# EAGLE schematic Node#1 (EAGLE 9.2.1)
Assembly variants: Relais, Mosfet

## Sheet 1 of 7
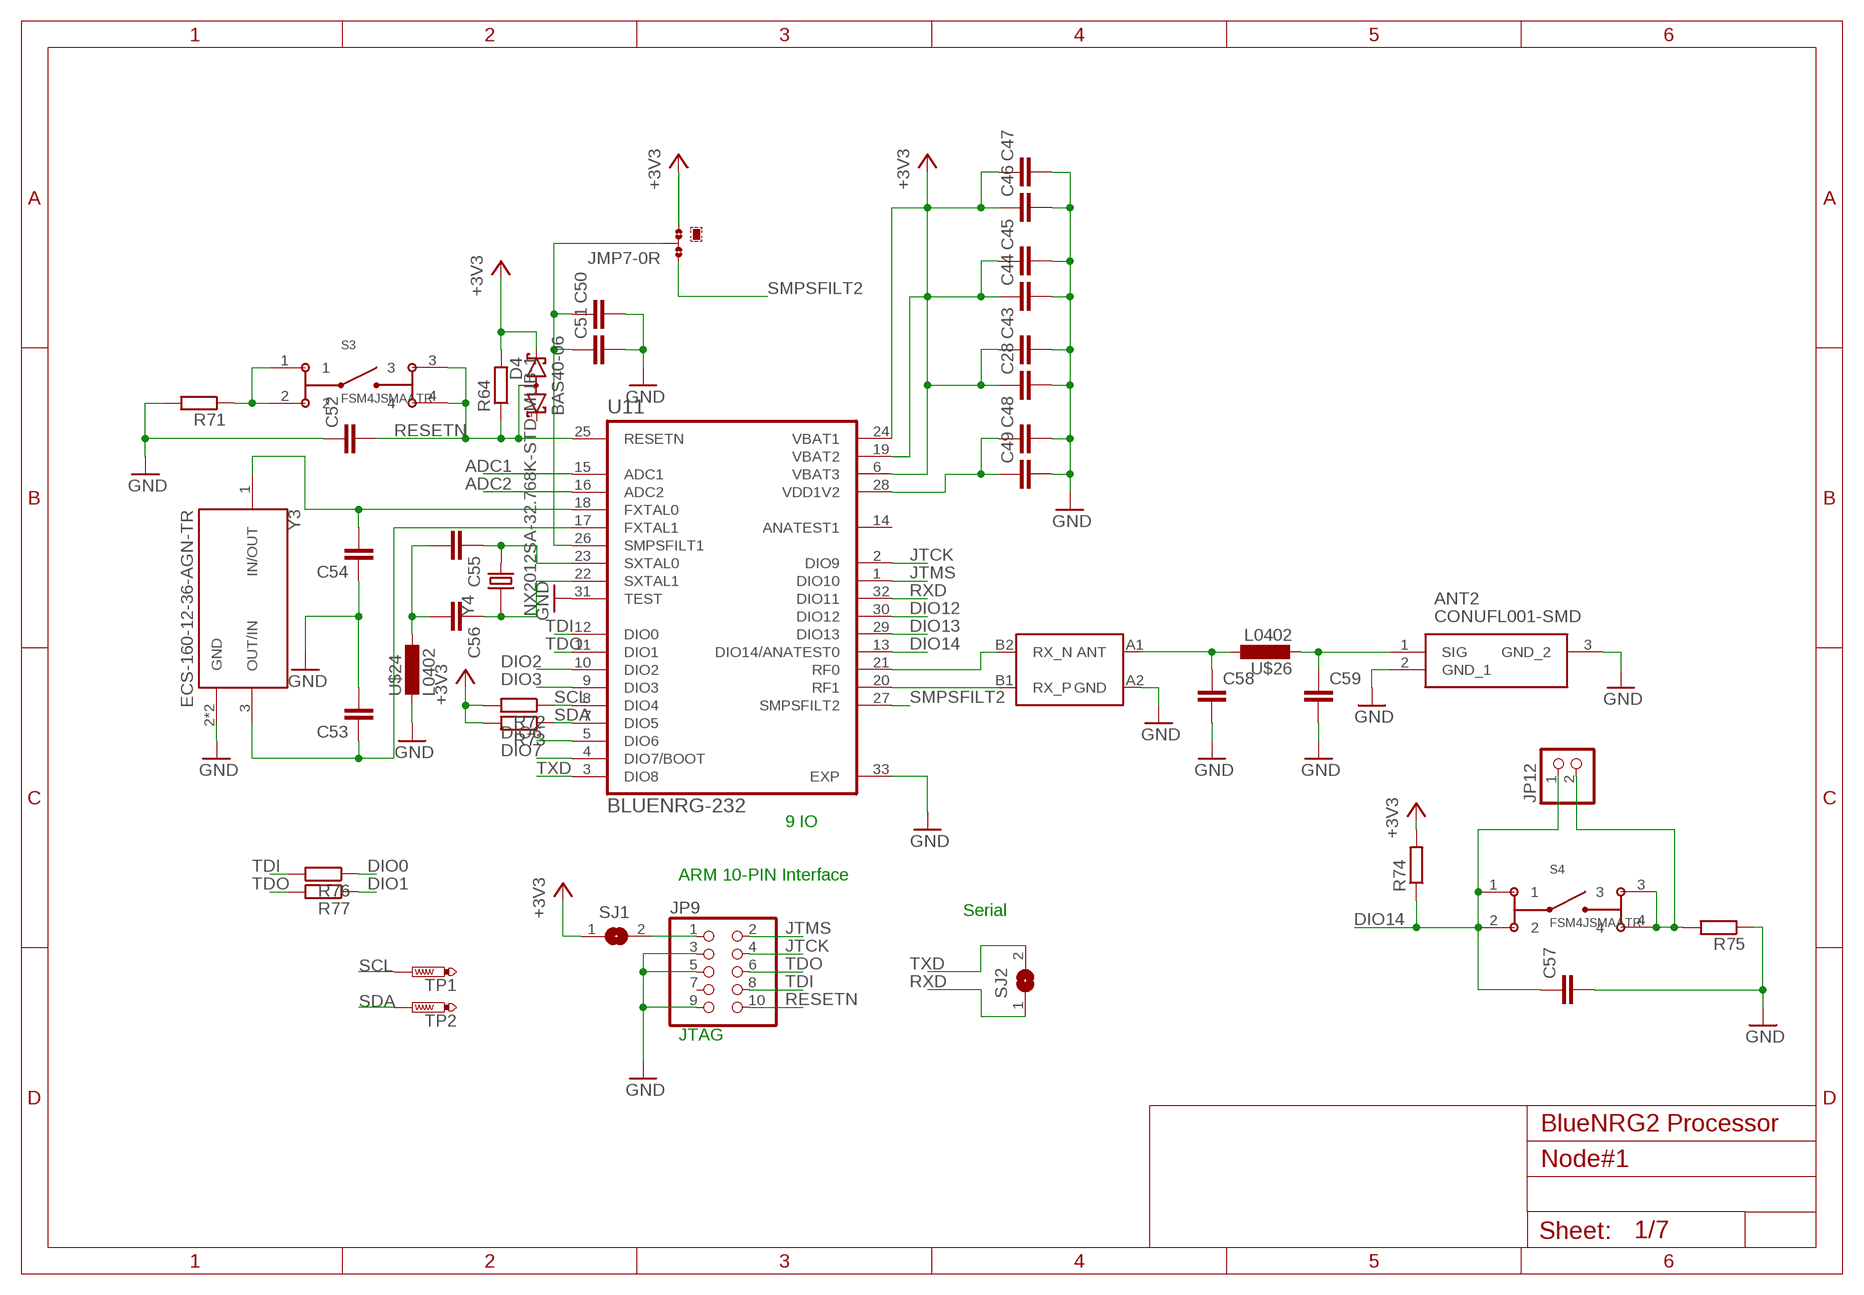
[diagram p0: schematic, sheet 1]

### Parts
ANT2  CONUFL001-SMD  [CONUFL001-SMD]
C28  C-EUC0805K  [C0805K]
C43  C-EUC0805K  [C0805K]
C44  C-EUC0805K  [C0805K]
C45  C-EUC0805K  [C0805K]
C46  C-EUC0805K  [C0805K]
C47  C-EUC0805K  [C0805K]
C48  C-EUC0805K  [C0805K]
C49  C-EUC0805K  [C0805K]
C50  C-EUC0805K  [C0805K]
C51  C-EUC0805K  [C0805K]
C52  C-EUC0805  [C0805]
C53  C-EUC0805  [C0805]
C54  C-EUC0805  [C0805]
C55  C-EUC0805  [C0805]
C56  C-EUC0805  [C0805]
C57  C-EUC0805  [C0805]
C58  C-EUC0402  [C0402]
C59  C-EUC0402  [C0402]
D4  BAS40-06  [SOT23]
JMP7  0R-JUMPA  [A0R-JMP]
JP9  PINHD-2X5  [2X05]
JP12  PINHD-1X2  [1X02]
R64  R-EU_R0805  [R0805]
R71  R-EU_R0805  [R0805]
R72  R-EU_R0805  [R0805]
R73  R-EU_R0805  [R0805]
R74  R-EU_M0805  [M0805]
R75  R-EU_M0805  [M0805]
R76  R-EU_R0805  [R0805]
R77  R-EU_R0805  [R0805]
S3  FSM4JSMAATR  [SW_FSM4JSMAATR]
S4  FSM4JSMAATR  [SW_FSM4JSMAATR]
SJ1  SJ  [SJ]
SJ2  SJ  [SJ]
TP1  PTR1TP20R  [TP20R]
TP2  PTR1TP20R  [TP20R]
U11  BLUENRG-232  [QFN50P500X500X100-33T345N]
U$24  L0402  [R0402]
U$25  BALF-NRG-01D3  [FLIPCHIP]
U$26  L0402  [R0402]
Y3  ECS-160-12-36-AGN-TR  [XTAL_ECS-160-12-36-AGN-TR]
Y4  NX2012SA-32.768K-STD-MUB-1  [XTAL_NX2012SA-32.768K-STD-MUB-1]

### Nets
+3V3: C28.1 C43.1 C44.1 C45.1 C46.1 C47.1 D4.2(K2) JMP7.3 R64.2 R72.2 R73.2 R74.2 SJ1.1 U11.6(VBAT3) U11.19(VBAT2) U11.24(VBAT1) ; also sheet 2,3,4,6
ADC1: U11.15(ADC1)
ADC2: U11.16(ADC2) ; also sheet 3,5
DIO0: R76.1
DIO1: R77.1
DIO2: U11.10(DIO2) ; also sheet 3
DIO3: U11.9(DIO3) ; also sheet 3
DIO6: U11.5(DIO6) ; also sheet 3
DIO7: U11.4(DIO7/BOOT) ; also sheet 3
DIO12: U11.30(DIO12) ; also sheet 4,7
DIO13: U11.29(DIO13) ; also sheet 6
DIO14: C57.1 JP12.1 R74.1 S4.1 S4.2 U11.13(DIO14/ANATEST0)
GND: ANT2.2(GND_1) ANT2.3(GND_2) C28.2 C43.2 C44.2 C45.2 C46.2 C47.2 C48.2 C49.2 C50.2 C51.2 C52.1 C53.2 C54.1 C57.2 C58.2 C59.2 JP9.3 JP9.5 JP9.9 R71.2 R75.1 U11.31(TEST) U11.33(EXP) U$24.2 U$25.A2(GND) Y3.2(GND) Y3.4(GND) ; also sheet 2,3,4,5,6,7
JTCK: JP9.4 U11.2(DIO9)
JTMS: JP9.2 U11.1(DIO10)
N$15: C48.1 C49.1 U11.28(VDD1V2)
N$18: C50.1 C51.1 JMP7.2 U11.26(SMPSFILT1)
N$20: R71.1 S3.1 S3.2
N$21: C53.1 U11.17(FXTAL1) Y3.3(OUT/IN)
N$22: C54.2 U11.18(FXTAL0) Y3.1(IN/OUT)
N$23: C55.2 C56.2 U$24.1
N$24: C55.1 U11.23(SXTAL0) Y4.2
N$25: C56.1 U11.22(SXTAL1) Y4.1
N$26: C58.1 U$25.A1(ANT) U$26.1
N$27: ANT2.1(SIG) C59.1 U$26.2
N$28: JP9.1 SJ1.2
N$29: JP12.2 R75.2 S4.3 S4.4
N$30: U11.20(RF1) U$25.B1(RX_P)
N$31: U11.21(RF0) U$25.B2(RX_N)
RESETN: C52.2 D4.3(AA) JP9.10 R64.1 S3.3 S3.4 U11.25(RESETN) ; also sheet 6
RXD: SJ2.1 U11.32(DIO11)
SCL: R72.1 TP1.TP U11.8(DIO4) ; also sheet 4,6,7
SDA: R73.1 TP2.TP U11.7(DIO5) ; also sheet 4,6,7
SMPSFILT2: JMP7.1 U11.27(SMPSFILT2)
TDI: JP9.8 R76.2 U11.12(DIO0)
TDO: JP9.6 R77.2 U11.11(DIO1)
TXD: SJ2.2 U11.3(DIO8)
Unconnected: D4.1(K1) JP9.7 U11.14(ANATEST1)

### Notes on the sheet
- 9 IO
- ARM 10-PIN Interface
- Serial
- JTAG
- BlueNRG2 Processor

## Sheet 2 of 7
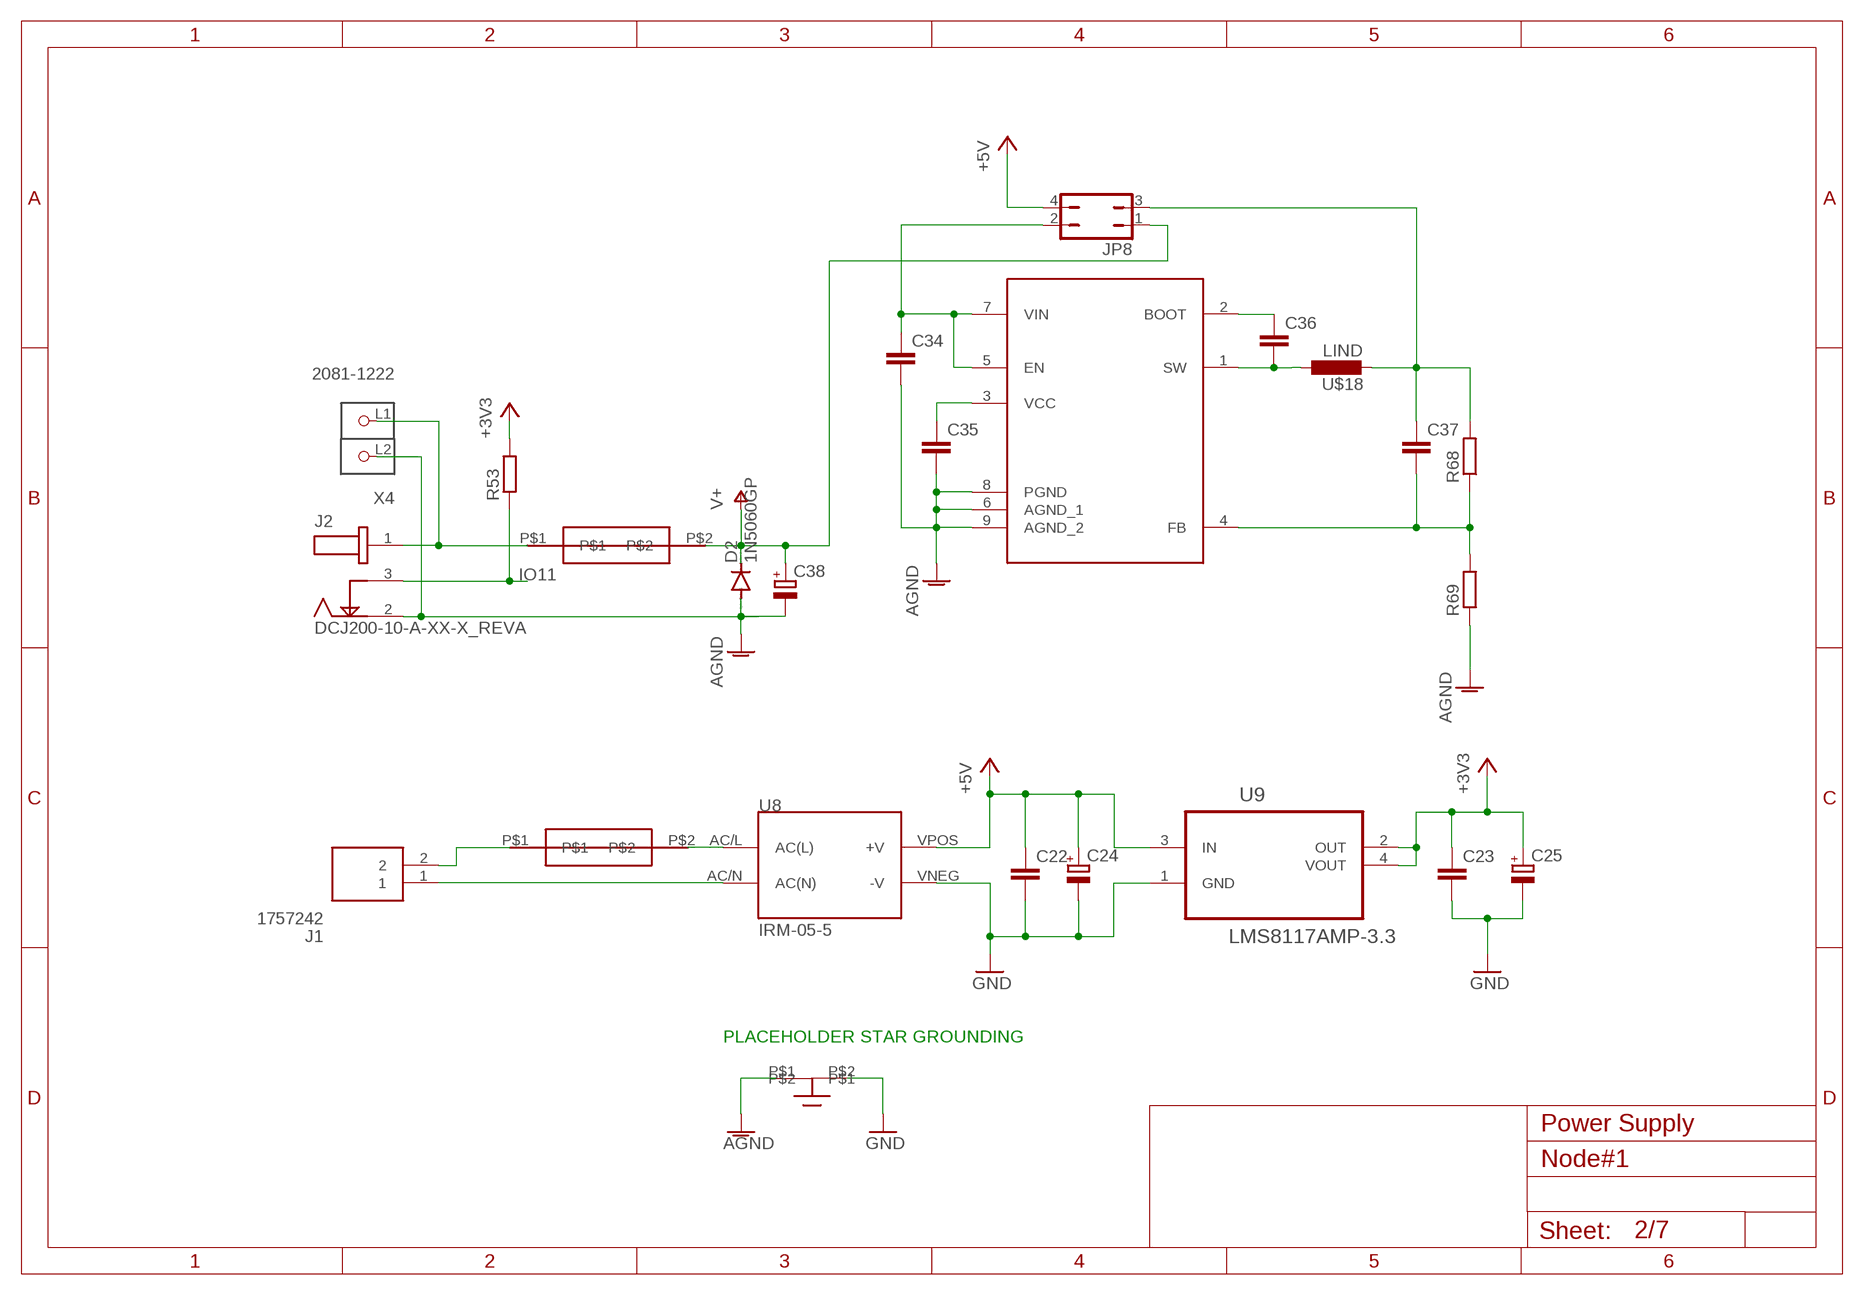
[diagram p1: schematic, sheet 2]

### Parts
C22  C-EUC0805  [C0805]
C23  C-EUC0805  [C0805]
C24  CPOL-EUSMCC  [SMC_C]
C25  CPOL-EUSMCC  [SMC_C]
C34  C-EUC0805  [C0805]
C35  C-EUC0805  [C0805]
C36  C-EUC0805  [C0805]
C37  C-EUC0805  [C0805]
C38  CPOL-EU150CLZ-1010  [150CLZ-1010]
D2  1N5060GP  [DO15-12]
J1  1757242  [SHDR2W120P0X508_1X2_1208X1200X]
J2  DCJ200-10-A-XX-X_REVA  [GCT_DCJ200-10-A-XX-X_REVA]
JP8  JP2Q  [JP2Q]
R53  R-EU_R0805  [R0805]
R68  R-EU_R0805  [R0805]
R69  R-EU_R0805  [R0805]
U8  IRM-05-5  [CONV_IRM-05-5]
U9  LMS8117AMP-3.3  [SOT230P696X180-4N]
U$9  RND170-00004  [RND170-00004]
U$18  LIND  [INDM1200X1200X1000N]
U$20  RND170-00004  [RND170-00004]
U$21  LM23610  [SOIC127P600X170-8N]
U$23  STAR_GROUND  [STAR_GROUND]
X4  2081-1222  [P-2081-1222]

### Nets
+3V3: C23.1 C25.+ R53.2 U9.2(OUT) U9.4(VOUT) ; also sheet 1,3,4,6
+5V: C22.1 C24.+ JP8.4 U8.VPOS(+V) U9.3(IN) ; also sheet 3,5,6,7
AGND: C34.2 C35.2 C38.- D2.A J2.2 R69.1 U$21.6(AGND_1) U$21.8(PGND) U$21.9(AGND_2) U$23.P$1 X4.L2(P2) ; also sheet 3,4,5
GND: C22.2 C23.2 C24.- C25.- U8.VNEG(-V) U9.1(GND) U$23.P$2 ; also sheet 1,3,4,5,6,7
IO11: J2.3 R53.1 ; also sheet 6
N$42: J2.1 U$20.P$1 X4.L1(P1)
N$45: C34.1 JP8.2 U$21.5(EN) U$21.7(VIN)
N$51: C35.1 U$21.3(VCC)
N$95: U8.AC/L(AC(L)) U$9.P$2
N$97: C36.1 U$21.2(BOOT)
N$98: J1.1 U8.AC/N(AC(N))
N$104: J1.2 U$9.P$1
N$107: C36.2 U$18.1 U$21.1(SW)
N$115: C37.2 R68.1 R69.2 U$21.4(FB)
N$116: C37.1 JP8.3 R68.2 U$18.2
V+: C38.+ D2.C JP8.1 U$20.P$2 ; also sheet 3,4

### Notes on the sheet
- PLACEHOLDER STAR GROUNDING
- Power Supply

## Sheet 3 of 7
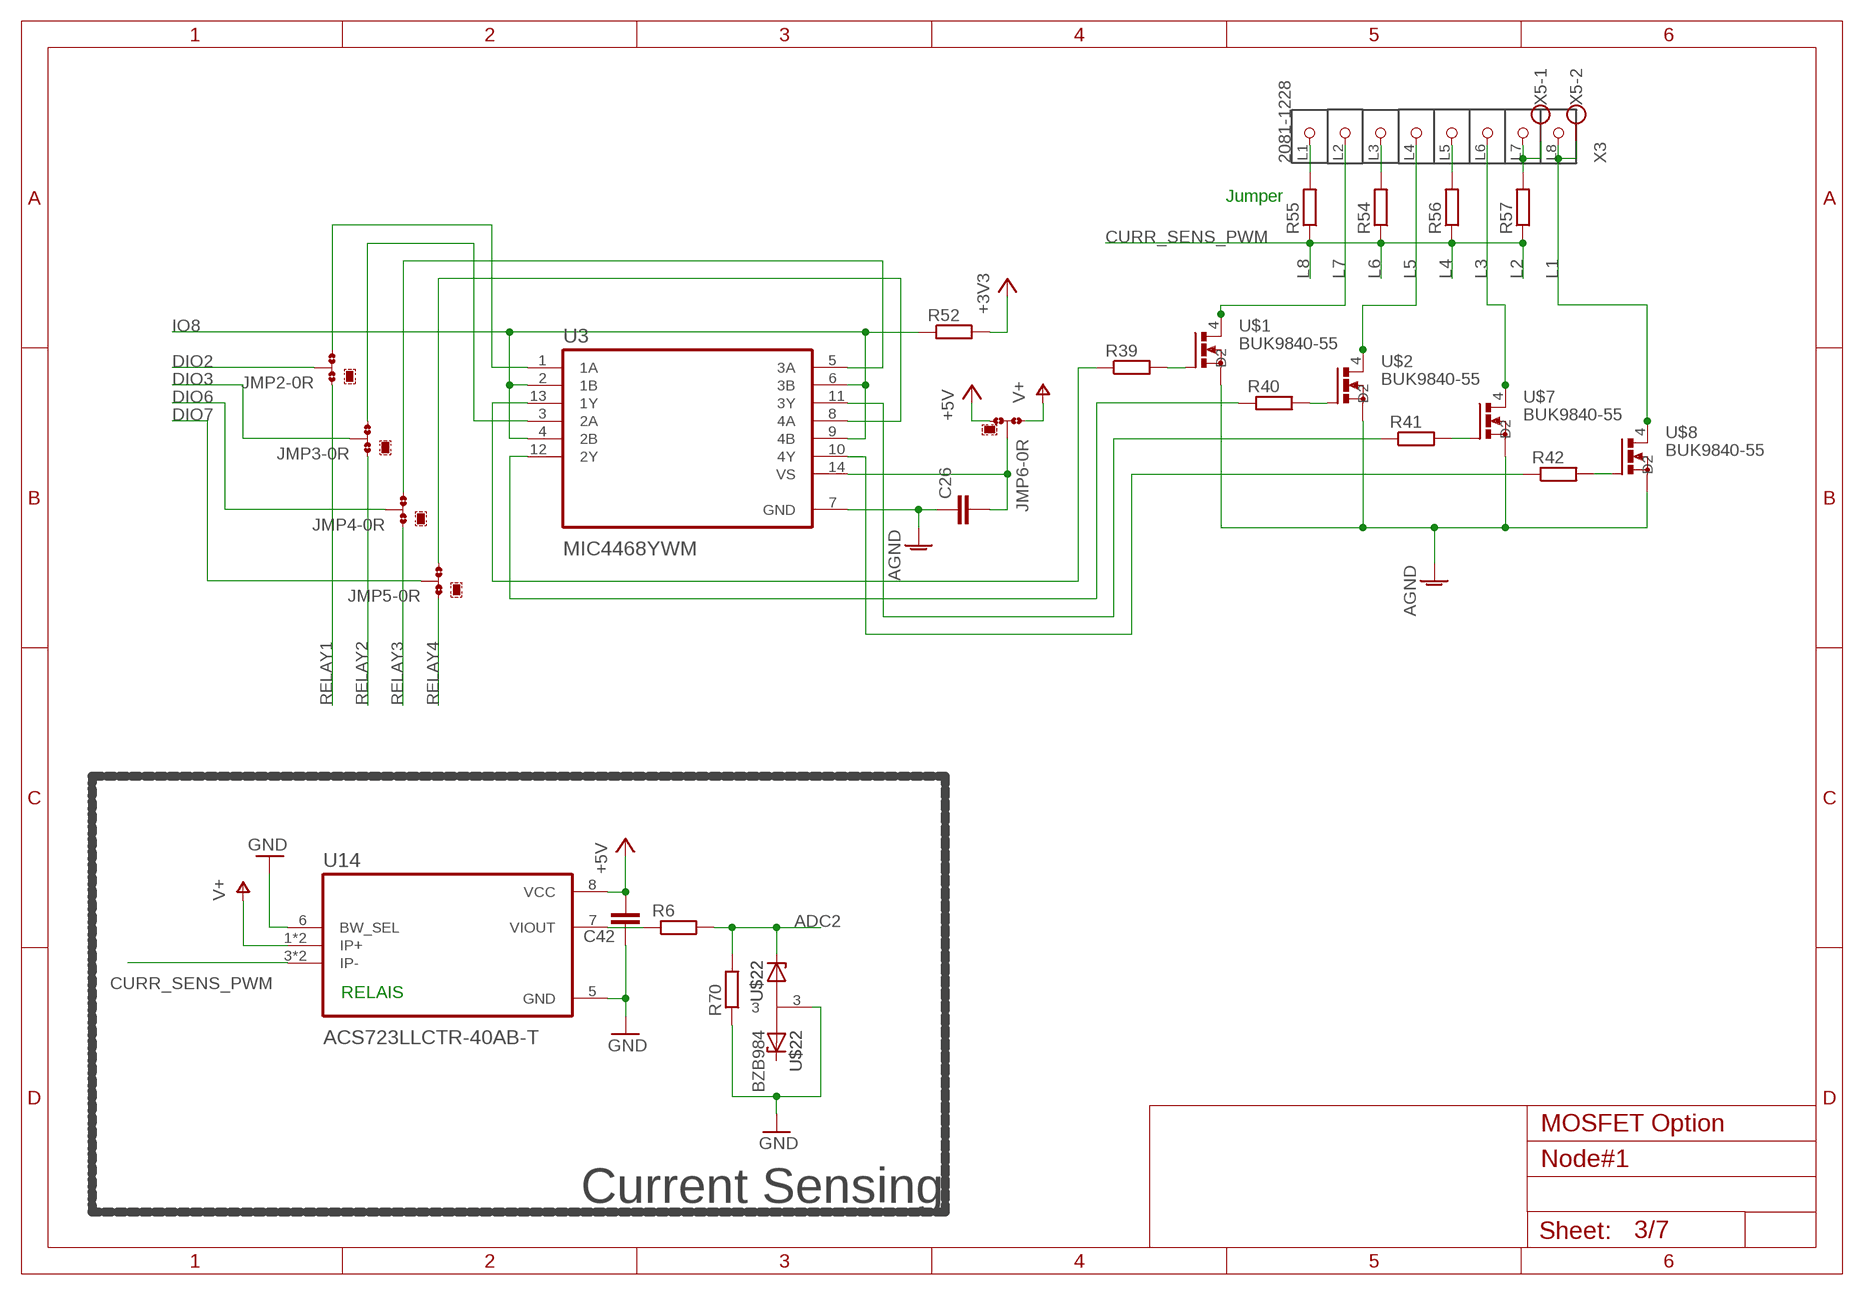
[diagram p2: schematic, sheet 3]

### Parts
C26  C-EUC0805  [C0805]  (not fitted in variant Relais)
C42  C-EUC0805  [C0805]  (not fitted in variant Relais)
JMP2  0R-JUMPA  [A0R-JMP]
JMP3  0R-JUMPA  [A0R-JMP]
JMP4  0R-JUMPA  [A0R-JMP]
JMP5  0R-JUMPA  [A0R-JMP]
JMP6  0R-JUMPA  [A0R-JMP]  (not fitted in variant Relais)
R6  R-EU_M0805  [M0805]  (not fitted in variant Relais)
R39  R-EU_M0805  [M0805]  (not fitted in variant Relais)
R40  R-EU_M0805  [M0805]  (not fitted in variant Relais)
R41  R-EU_M0805  [M0805]  (not fitted in variant Relais)
R42  R-EU_M0805  [M0805]  (not fitted in variant Relais)
R52  R-EU_M0805  [M0805]  (not fitted in variant Relais)
R54  R-EU_R1210  [R1210]  (not fitted in variant Relais)
R55  R-EU_R1210  [R1210]  (not fitted in variant Relais)
R56  R-EU_R1210  [R1210]  (not fitted in variant Relais)
R57  R-EU_R1210  [R1210]  (not fitted in variant Relais)
R70  R-EU_M0805  [M0805]  (not fitted in variant Relais)
U3  MIC4468YWM  [SOIC127P1030X265-16N]  (not fitted in variant Relais)
U14  ACS723LLCTR-40AB-T  [SOIC127P600X175-8N]  (not fitted in variant Relais)
U$1  BUK9840-55  [SOT230P696X180-4N]  (not fitted in variant Relais)
U$2  BUK9840-55  [SOT230P696X180-4N]  (not fitted in variant Relais)
U$7  BUK9840-55  [SOT230P696X180-4N]  (not fitted in variant Relais)
U$8  BUK9840-55  [SOT230P696X180-4N]  (not fitted in variant Relais)
U$22  BZB984  [SOT95P230X110-3N]  (not fitted in variant Relais)
X3  2081-1228  [P-2081-1228]
X5  W237-102  [W237-102]

### Nets
+3V3: R52.2 ; also sheet 1,2,4,6
+5V: C42.2 JMP6.3 U14.8(VCC) ; also sheet 2,5,6,7
ADC2: R6.2 R70.2 U$22.1 ; also sheet 1,5
AGND: C26.1 U3.7(GND) U$1.3(S) U$2.3(S) U$7.3(S) U$8.3(S) ; also sheet 2,4,5
CURR_SENS_PWM: R54.1 R55.1 R56.1 R57.1 U14.3(IP-) U14.4(IP-)
DIO2: JMP2.2 ; also sheet 1
DIO3: JMP3.2 ; also sheet 1
DIO6: JMP4.2 ; also sheet 1
DIO7: JMP5.2 ; also sheet 1
GND: C42.1 R70.1 U14.5(GND) U14.6(BW_SEL) U$22.3 ; also sheet 1,2,4,5,6,7
IO8: R52.1 U3.2(1B) U3.4(2B) U3.6(3B) U3.9(4B) ; also sheet 4,6
L1: U$8.2(D) U$8.4(D2) X3.L8(P8) X5.2 ; also sheet 4,5
L2: R57.2 X3.L7(P7) X5.1 ; also sheet 5
L3: U$7.2(D) U$7.4(D2) X3.L6(P6) ; also sheet 4,5
L4: R56.2 X3.L5(P5) ; also sheet 5
L5: U$2.2(D) U$2.4(D2) X3.L4(P4) ; also sheet 4,5
L6: R54.2 X3.L3(P3) ; also sheet 5
L7: U$1.2(D) U$1.4(D2) X3.L2(P2) ; also sheet 4,5
L8: R55.2 X3.L1(P1) ; also sheet 5
N$39: JMP5.3 U3.8(4A)
N$53: R39.1 U3.13(1Y)
N$55: JMP2.3 U3.1(1A)
N$56: JMP3.3 U3.3(2A)
N$57: JMP4.3 U3.5(3A)
N$67: R40.1 U3.12(2Y)
N$70: R41.1 U3.11(3Y)
N$73: R42.1 U3.10(4Y)
N$74: R39.2 U$1.1(G)
N$75: R40.2 U$2.1(G)
N$76: R41.2 U$7.1(G)
N$77: R42.2 U$8.1(G)
N$96: R6.1 U14.7(VIOUT)
N$105: C26.2 JMP6.2 U3.14(VS)
RELAY1: JMP2.1 ; also sheet 5
RELAY2: JMP3.1 ; also sheet 5
RELAY3: JMP4.1 ; also sheet 5
RELAY4: JMP5.1 ; also sheet 5
V+: JMP6.1 U14.1(IP+) U14.2(IP+) ; also sheet 2,4
Unconnected: U$22.2

### Notes on the sheet
- Jumper
- RELAIS
- MOSFET Option
- Current Sensing

## Sheet 4 of 7
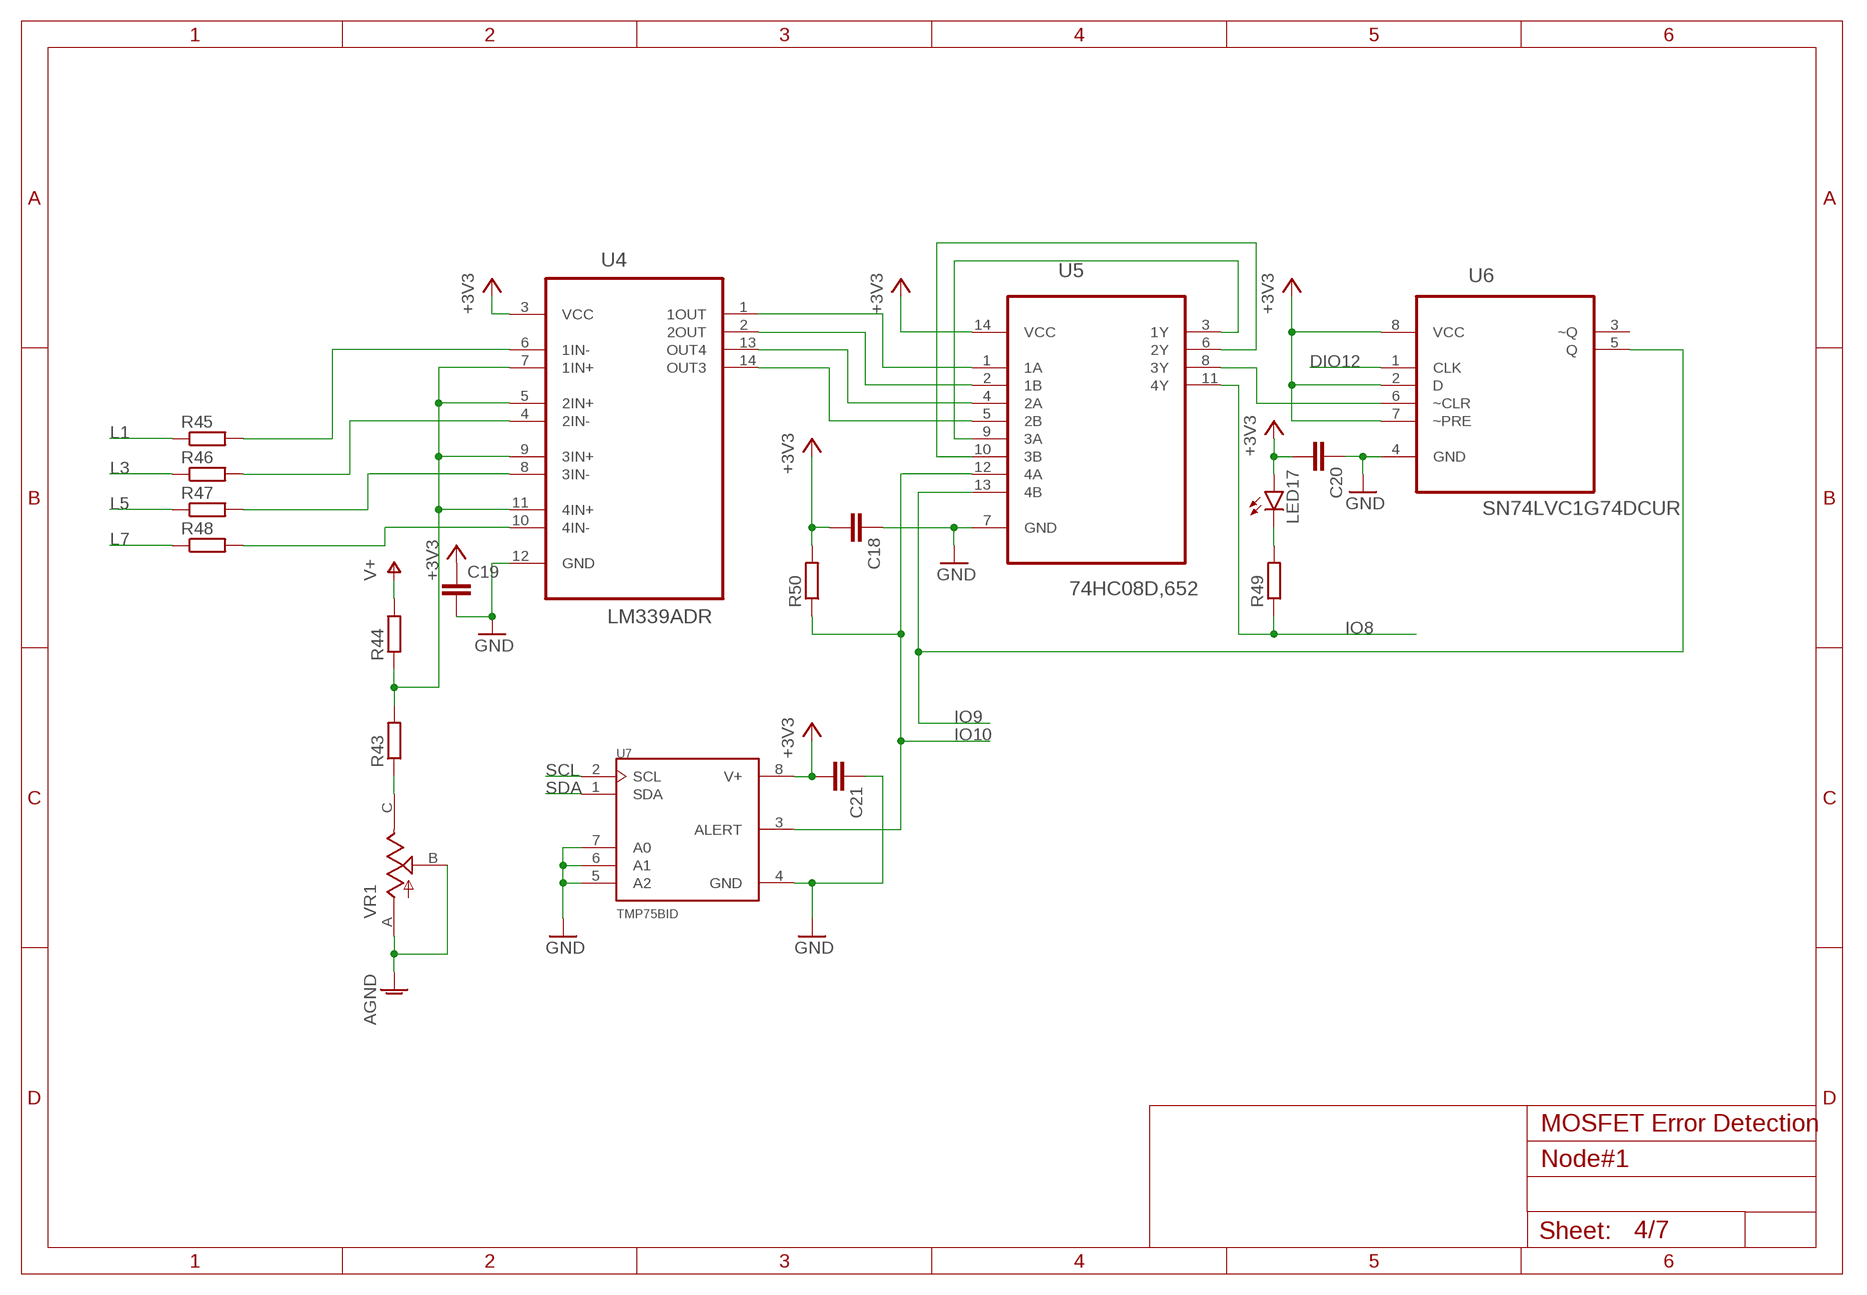
[diagram p3: schematic, sheet 4]

### Parts
C18  C-EUC0805  [C0805]  (not fitted in variant Relais)
C19  C-EUC0805  [C0805]  (not fitted in variant Relais)
C20  C-EUC0805  [C0805]  (not fitted in variant Relais)
C21  C-EUC0805  [C0805]  (not fitted in variant Relais)
LED17  LED3MM  [LED3MM]  (not fitted in variant Relais)
R43  R-EU_M0805  [M0805]  (not fitted in variant Relais)
R44  R-EU_M0805  [M0805]  (not fitted in variant Relais)
R45  R-EU_M0805  [M0805]  (not fitted in variant Relais)
R46  R-EU_M0805  [M0805]  (not fitted in variant Relais)
R47  R-EU_M0805  [M0805]  (not fitted in variant Relais)
R48  R-EU_M0805  [M0805]  (not fitted in variant Relais)
R49  R-EU_M0805  [M0805]  (not fitted in variant Relais)
R50  R-EU_M0805  [M0805]  (not fitted in variant Relais)
U4  LM339ADR  [SOIC127P600X175-14N]  (not fitted in variant Relais)
U5  74HC08D,652  [SOIC127P600X175-14N]  (not fitted in variant Relais)
U6  SN74LVC1G74DCUR  [SOP50P310X90-8N]  (not fitted in variant Relais)
U7  TMP75BID  [SOIC127P600X175-8N]  (not fitted in variant Relais)
VR1  TS53YJ103MR10  [TRIM_TS53YJ103MR10]  (not fitted in variant Relais)

### Nets
+3V3: C18.2 C19.1 C20.2 C21.2 LED17.A R50.2 U4.3(VCC) U5.14(VCC) U6.2(D) U6.7(~PRE) U6.8(VCC) U7.8(V+) ; also sheet 1,2,3,6
AGND: VR1.A VR1.B ; also sheet 2,3,5
DIO12: U6.1(CLK) ; also sheet 1,7
GND: C18.1 C19.2 C20.1 C21.1 U4.12(GND) U5.7(GND) U6.4(GND) U7.4(GND) U7.5(A2) U7.6(A1) U7.7(A0) ; also sheet 1,2,3,5,6,7
IO8: R49.1 U5.11(4Y) ; also sheet 3,6
IO9: U5.13(4B) U6.5(Q) ; also sheet 6
IO10: R50.1 U5.12(4A) U7.3(ALERT) ; also sheet 6
L1: R45.1 ; also sheet 3,5
L3: R46.1 ; also sheet 3,5
L5: R47.1 ; also sheet 3,5
L7: R48.1 ; also sheet 3,5
N$44: LED17.K(C) R49.2
N$82: R43.1 VR1.C
N$83: R43.2 R44.1 U4.5(2IN+) U4.7(1IN+) U4.9(3IN+) U4.11(4IN+)
N$84: R45.2 U4.6(1IN-)
N$85: U4.1(1OUT) U5.1(1A)
N$86: R48.2 U4.10(4IN-)
N$87: R47.2 U4.8(3IN-)
N$88: R46.2 U4.4(2IN-)
N$89: U4.2(2OUT) U5.2(1B)
N$90: U4.13(OUT4) U5.4(2A)
N$91: U4.14(OUT3) U5.5(2B)
N$92: U5.3(1Y) U5.9(3A)
N$93: U5.6(2Y) U5.10(3B)
N$94: U5.8(3Y) U6.6(~CLR)
SCL: U7.2(SCL) ; also sheet 1,6,7
SDA: U7.1(SDA) ; also sheet 1,6,7
V+: R44.2 ; also sheet 2,3
Unconnected: U6.3(~Q)

### Notes on the sheet
- MOSFET Error Detection

## Sheet 5 of 7
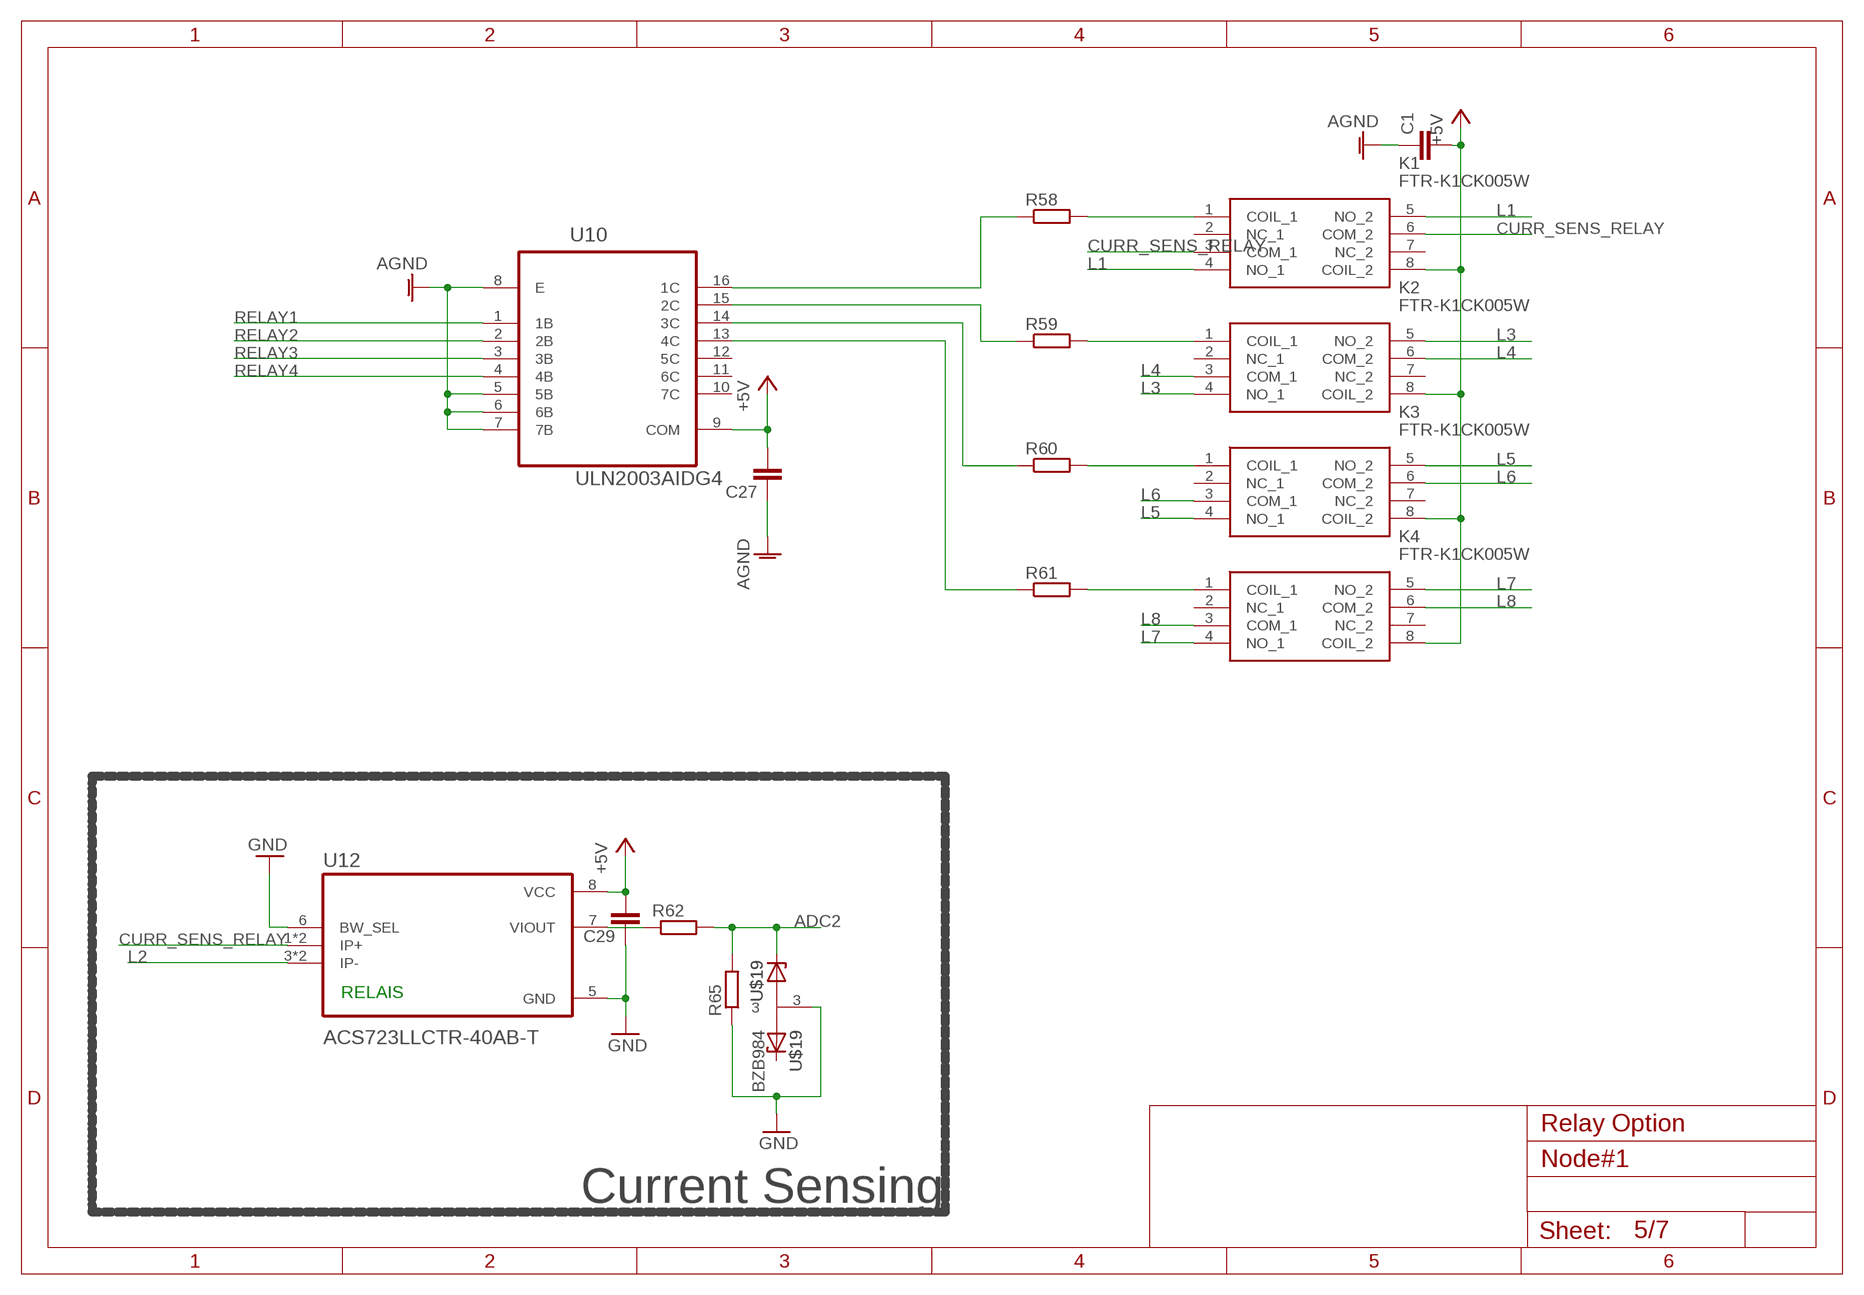
[diagram p4: schematic, sheet 5]

### Parts
C1  C-EUC0805  [C0805]  (not fitted in variant Mosfet)
C27  C-EUC0805  [C0805]  (not fitted in variant Mosfet)
C29  C-EUC0805  [C0805]  (not fitted in variant Mosfet)
K1  FTR-K1CK005W  [FTRK1CK005W]  (not fitted in variant Mosfet)
K2  FTR-K1CK005W  [FTRK1CK005W]  (not fitted in variant Mosfet)
K3  FTR-K1CK005W  [FTRK1CK005W]  (not fitted in variant Mosfet)
K4  FTR-K1CK005W  [FTRK1CK005W]  (not fitted in variant Mosfet)
R58  R-EU_M0805  [M0805]  (not fitted in variant Mosfet)
R59  R-EU_M0805  [M0805]  (not fitted in variant Mosfet)
R60  R-EU_M0805  [M0805]  (not fitted in variant Mosfet)
R61  R-EU_M0805  [M0805]  (not fitted in variant Mosfet)
R62  R-EU_R0805  [R0805]  (not fitted in variant Mosfet)
R65  R-EU_R0805  [R0805]  (not fitted in variant Mosfet)
U10  ULN2003AIDG4  [SOIC127P600X175-16N]  (not fitted in variant Mosfet)
U12  ACS723LLCTR-40AB-T  [SOIC127P600X175-8N]  (not fitted in variant Mosfet)
U$19  BZB984  [SOT95P230X110-3N]  (not fitted in variant Mosfet)

### Nets
+5V: C1.2 C27.2 C29.2 K1.8(COIL_2) K2.8(COIL_2) K3.8(COIL_2) K4.8(COIL_2) U10.9(COM) U12.8(VCC) ; also sheet 2,3,6,7
ADC2: R62.2 R65.2 U$19.1 ; also sheet 1,3
AGND: C1.1 C27.1 U10.5(5B) U10.6(6B) U10.7(7B) U10.8(E) ; also sheet 2,3,4
CURR_SENS_RELAY: K1.3(COM_1) K1.6(COM_2) U12.1(IP+) U12.2(IP+)
GND: C29.1 R65.1 U12.5(GND) U12.6(BW_SEL) U$19.3 ; also sheet 1,2,3,4,6,7
L1: K1.4(NO_1) K1.5(NO_2) ; also sheet 3,4
L2: U12.3(IP-) U12.4(IP-) ; also sheet 3
L3: K2.4(NO_1) K2.5(NO_2) ; also sheet 3,4
L4: K2.3(COM_1) K2.6(COM_2) ; also sheet 3
L5: K3.4(NO_1) K3.5(NO_2) ; also sheet 3,4
L6: K3.3(COM_1) K3.6(COM_2) ; also sheet 3
L7: K4.4(NO_1) K4.5(NO_2) ; also sheet 3,4
L8: K4.3(COM_1) K4.6(COM_2) ; also sheet 3
N$78: K1.1(COIL_1) R58.2
N$79: K2.1(COIL_1) R59.2
N$80: K3.1(COIL_1) R60.2
N$81: K4.1(COIL_1) R61.2
N$106: R58.1 U10.16(1C)
N$108: R59.1 U10.15(2C)
N$109: R60.1 U10.14(3C)
N$110: R61.1 U10.13(4C)
N$111: R62.1 U12.7(VIOUT)
RELAY1: U10.1(1B) ; also sheet 3
RELAY2: U10.2(2B) ; also sheet 3
RELAY3: U10.3(3B) ; also sheet 3
RELAY4: U10.4(4B) ; also sheet 3
Unconnected: K1.2(NC_1) K1.7(NC_2) K2.2(NC_1) K2.7(NC_2) K3.2(NC_1) K3.7(NC_2) K4.2(NC_1) K4.7(NC_2) U10.10(7C) U10.11(6C) U10.12(5C) U$19.2

### Notes on the sheet
- RELAIS
- Relay Option
- Current Sensing

## Sheet 6 of 7
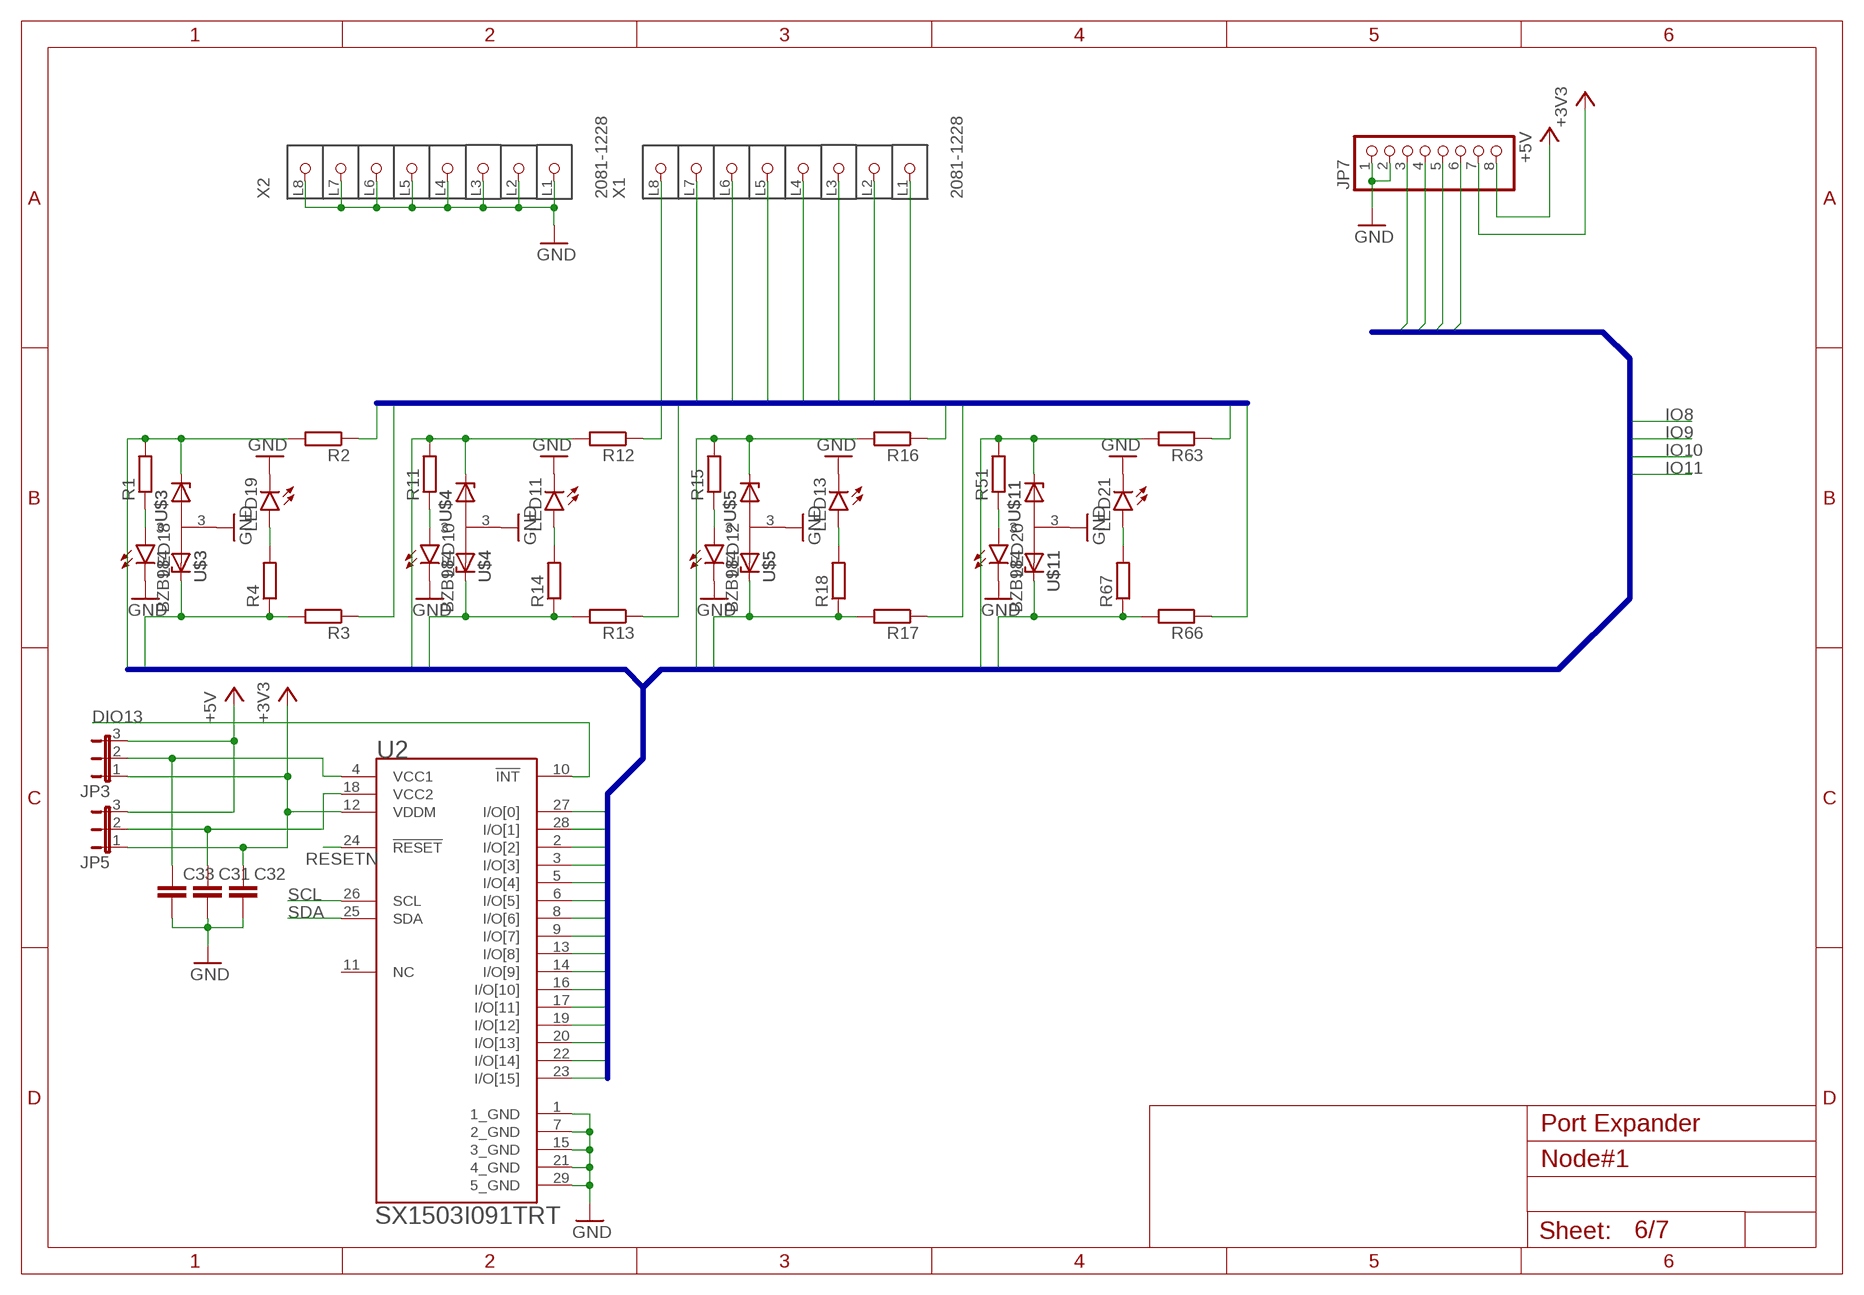
[diagram p5: schematic, sheet 6]

### Parts
C31  C-EUC0805  [C0805]
C32  C-EUC0805  [C0805]
C33  C-EUC0805  [C0805]
JP3  JP2E  [JP2]
JP5  JP2E  [JP2]
JP7  PINHD-1X8  [1X08]
LED10  LED3MM  [LED3MM]
LED11  LED3MM  [LED3MM]
LED12  LED3MM  [LED3MM]
LED13  LED3MM  [LED3MM]
LED18  LED3MM  [LED3MM]
LED19  LED3MM  [LED3MM]
LED20  LED3MM  [LED3MM]
LED21  LED3MM  [LED3MM]
R1  R-EU_R0805  [R0805]
R2  R-EU_R0805  [R0805]
R3  R-EU_R0805  [R0805]
R4  R-EU_R0805  [R0805]
R11  R-EU_R0805  [R0805]
R12  R-EU_R0805  [R0805]
R13  R-EU_R0805  [R0805]
R14  R-EU_R0805  [R0805]
R15  R-EU_R0805  [R0805]
R16  R-EU_R0805  [R0805]
R17  R-EU_R0805  [R0805]
R18  R-EU_R0805  [R0805]
R51  R-EU_R0805  [R0805]
R63  R-EU_R0805  [R0805]
R66  R-EU_R0805  [R0805]
R67  R-EU_R0805  [R0805]
U2  SEMTECH_SX1503I091TRTSEMTECH_SX1503I091TRT_0_0  [SEMTECH_SX1503I091TRT_0]
U$3  BZB984  [SOT95P230X110-3N]
U$4  BZB984  [SOT95P230X110-3N]
U$5  BZB984  [SOT95P230X110-3N]
U$11  BZB984  [SOT95P230X110-3N]
X1  2081-1228  [P-2081-1228]
X2  2081-1228  [P-2081-1228]

### Nets
+3V3: C32.1 JP3.1 JP5.1 JP7.7 U2.12(VDDM) ; also sheet 1,2,3,4
+5V: JP3.3 JP5.3 JP7.8 ; also sheet 2,3,5,7
DIO13: U2.10(!INT!) ; also sheet 1
GND: C31.2 C32.2 C33.2 JP7.1 JP7.2 LED10.K(C) LED11.K(C) LED12.K(C) LED13.K(C) LED18.K(C) LED19.K(C) LED20.K(C) LED21.K(C) U2.1(1_GND) U2.7(2_GND) U2.15(3_GND) U2.21(4_GND) U2.29(5_GND) U$3.3 U$4.3 U$5.3 U$11.3 X2.L1(P1) X2.L2(P2) X2.L3(P3) X2.L4(P4) X2.L5(P5) X2.L6(P6) X2.L7(P7) X2.L8(P8) ; also sheet 1,2,3,4,5,7
IO0: R1.2 R2.2 U2.27(I/O[0]) U$3.1
IO1: R3.2 R4.1 U2.28(I/O[1]) U$3.2
IO2: R11.2 R12.2 U2.2(I/O[2]) U$4.1
IO3: R13.2 R14.1 U2.3(I/O[3]) U$4.2
IO4: R15.2 R16.2 U2.5(I/O[4]) U$5.1
IO5: R17.2 R18.1 U2.6(I/O[5]) U$5.2
IO6: R51.2 R63.2 U2.8(I/O[6]) U$11.1
IO7: R66.2 R67.1 U2.9(I/O[7]) U$11.2
IO8: U2.13(I/O[8]) ; also sheet 3,4
IO9: U2.14(I/O[9]) ; also sheet 4
IO10: U2.16(I/O[10]) ; also sheet 4
IO11: U2.17(I/O[11]) ; also sheet 2
IO12: JP7.3 U2.19(I/O[12])
IO13: JP7.4 U2.20(I/O[13])
IO14: JP7.5 U2.22(I/O[14])
IO15: JP7.6 U2.23(I/O[15])
N$1: LED18.A R1.1
N$2: LED19.A R4.2
N$3: LED10.A R11.1
N$4: LED11.A R14.2
N$5: LED12.A R15.1
N$6: LED13.A R18.2
N$10: LED20.A R51.1
N$11: LED21.A R67.2
N$12: C33.1 JP3.2 U2.4(VCC1)
N$13: C31.1 JP5.2 U2.18(VCC2)
O_IO0: R2.1 X1.L1(P1)
O_IO1: R3.1 X1.L2(P2)
O_IO2: R12.1 X1.L3(P3)
O_IO3: R13.1 X1.L4(P4)
O_IO4: R16.1 X1.L5(P5)
O_IO5: R17.1 X1.L6(P6)
O_IO6: R63.1 X1.L7(P7)
O_IO7: R66.1 X1.L8(P8)
RESETN: U2.24(!RESET!) ; also sheet 1
SCL: U2.26(SCL) ; also sheet 1,4,7
SDA: U2.25(SDA) ; also sheet 1,4,7
Unconnected: U2.11(NC)

### Buses
IO0,IO1,IO2,IO3,IO4,IO5,IO6,IO7,IO8,IO9,IO10,IO11,IO12,IO13,IO14,IO15
O_IO0,O_IO1,O_IO2,O_IO3,O_IO4,O_IO5,O_IO6,O_IO7,O_IO8,O_IO9,O_IO10,O_IO11,O_IO12,O_IO13,O_IO14,O_IO15

### Notes on the sheet
- Port Expander

## Sheet 7 of 7
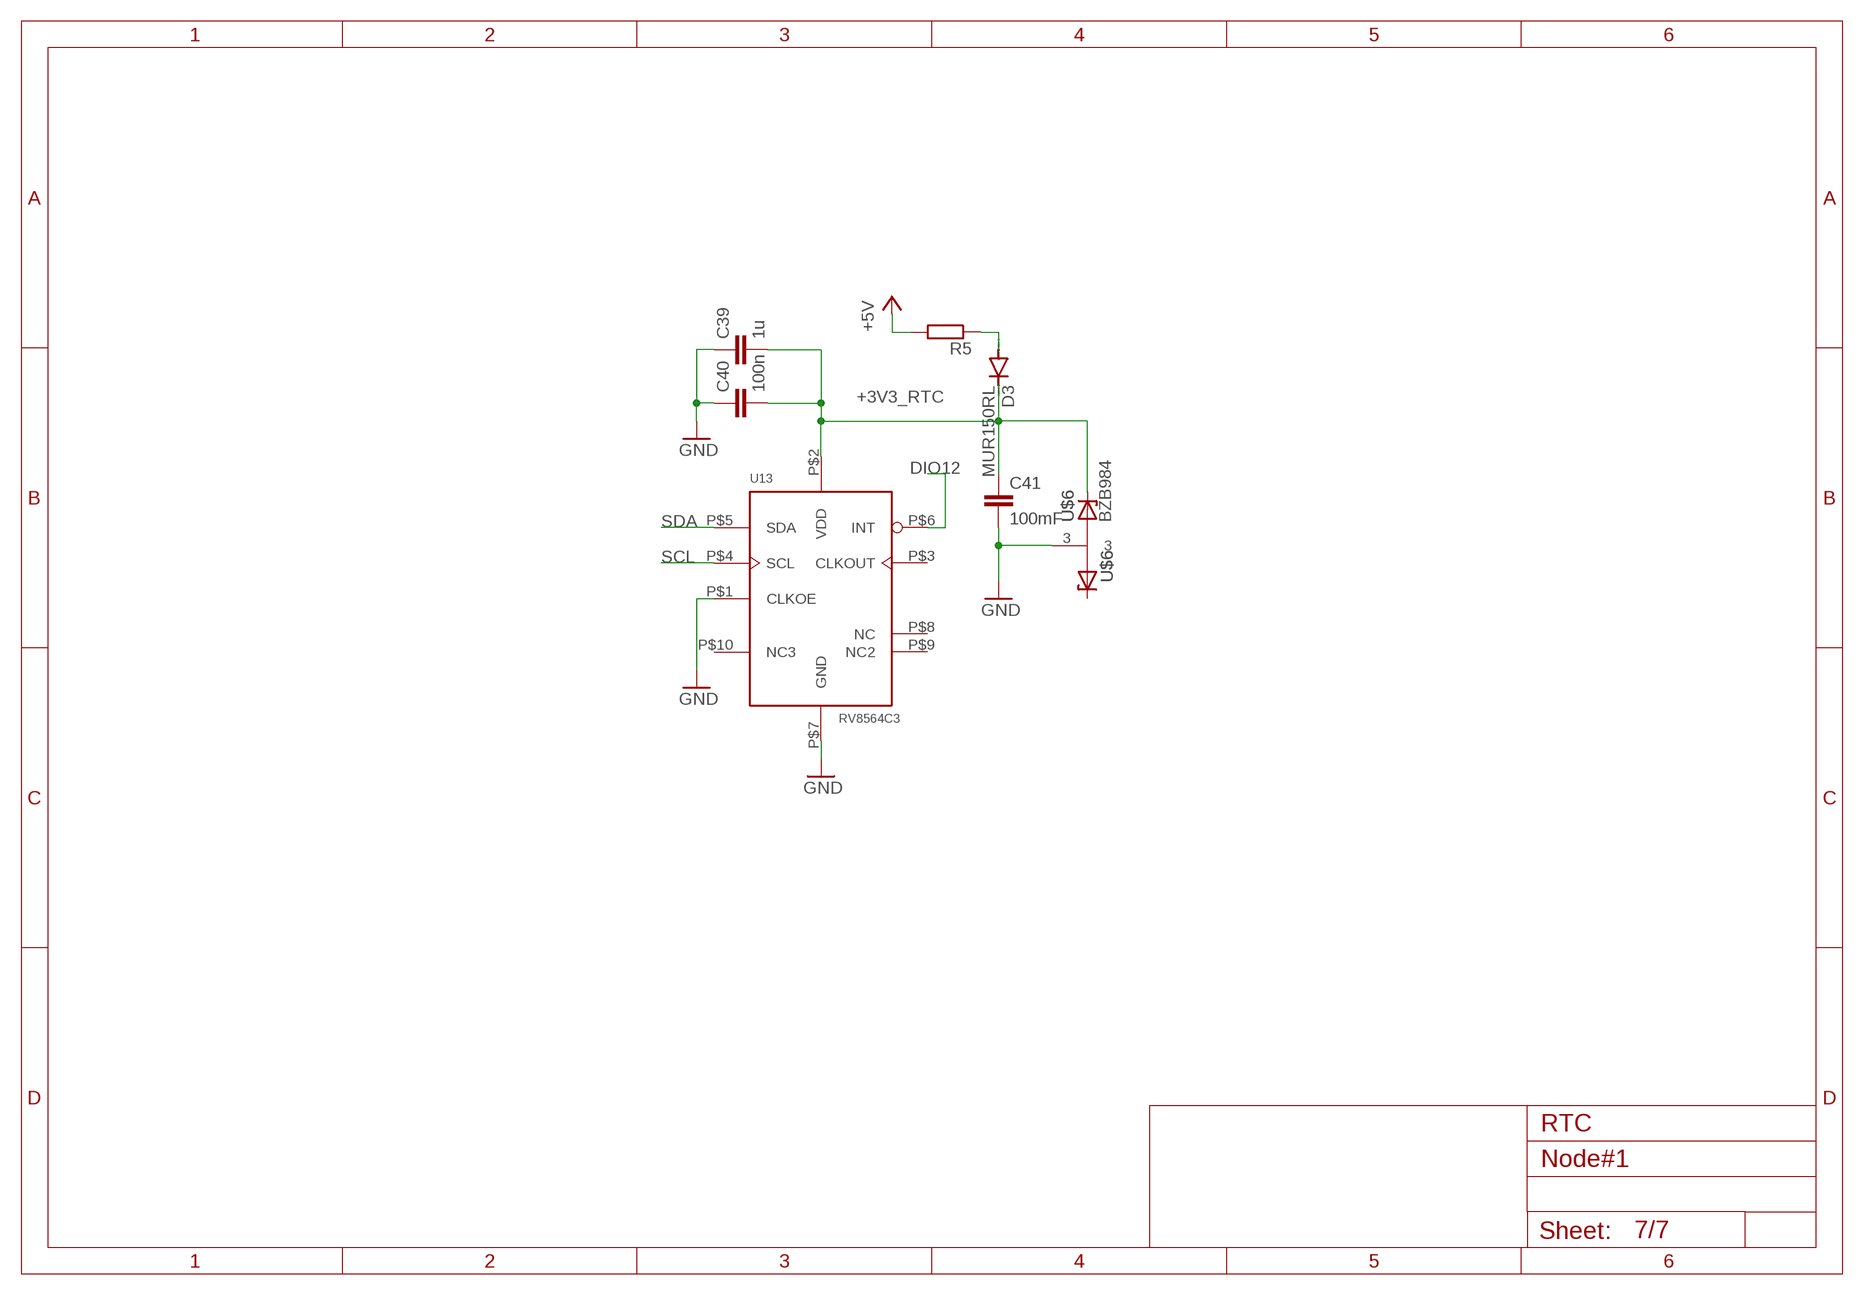
[diagram p6: schematic, sheet 7]

### Parts
C39  1u  C-EUC0805  [C0805]
C40  100n  C-EUC0805  [C0805]
C41  100mF  C-EU050-055X075  [C050-055X075]
D3  MUR150RL  [DO41-10]
R5  R-EU_R0805  [R0805]
U13  RV8564C3  [RTC-C3]
U$6  BZB984  [SOT95P230X110-3N]

### Nets
+3V3_RTC: C39.2 C40.2 C41.1 D3.C U13.P$2(VDD) U$6.2
+5V: R5.2 ; also sheet 2,3,5,6
DIO12: U13.P$6(INT) ; also sheet 1,4
GND: C39.1 C40.1 C41.2 U13.P$1(CLKOE) U13.P$7(GND) U$6.3 ; also sheet 1,2,3,4,5,6
N$8: D3.A R5.1
SCL: U13.P$4(SCL) ; also sheet 1,4,6
SDA: U13.P$5(SDA) ; also sheet 1,4,6
Unconnected: U13.P$3(CLKOUT) U13.P$8(NC) U13.P$9(NC2) U13.P$10(NC3) U$6.1

### Notes on the sheet
- RTC

## Library data of the parts
ANT2 = BlueHome:CONUFL001-SMD: RF Connectors / Coaxial Connectors U.FL Straight Surface Mount Jack Source: Datasheet <https://componentsearchengine.com/Datasheets/1/CONUFL001-SMD.pdf>; DESCRIPTION: RF Connectors / Coaxial Connectors U.FL Straight Surface Mount Jack; HEIGHT: mm; MANUFACTURER_NAME: Linx Technologies; MANUFACTURER_PART_NUMBER: CONUFL001-SMD; MOUSER_PART_NUMBER: 712-CONUFL001-SMD
C1 = rcl:C-EU: CAPACITOR, European symbol
C18-C23 C26-C29 C31-C37 C39-C59 = rcl:C-EU: CAPACITOR, European symbol; SPICEPREFIX: C
C24 C25 C38 = rcl:CPOL-EU: POLARIZED CAPACITOR, European symbol; SPICEPREFIX: C
D2 = diode:1N5060GP: DIODE controlled avalanche rectifier
D3 = diode:MUR150RL: DIODE
D4 = diode:BAS40-06: Silicon Schottky Diodes General-purpose diode for high-speed switching
J1 = BlueHome:1757242: 2 way horizontal PCB header,5.08mm pitch Phoenix Contact MSTBA Series, 5.08mm Pitch 2 Way 1 Row Right Angle PCB Header, Solder Termination, 12A Source: Datasheet <https://componentsearchengine.com/Datasheets/1/1757242.pdf>; DESCRIPTION: 2 way horizontal PCB header,5.08mm pitch Phoenix Contact MSTBA Series, 5.08mm Pitch 2 Way 1 Row Right Angle PCB Header, Solder Termination, 12A; HEIGHT: 8.6mm; MANUFACTURER_NAME: Phoenix Contact; MANUFACTURER_PART_NUMBER: 1757242; MOUSER_PART_NUMBER: 651-1757242
J2 = BlueHome:DCJ200-10-A-XX-X_REVA: DC Power Jack, Thru-Hole, Horizontal, with Locating Pegs, D2.0mm; AVAILABILITY: Unavailable; DESCRIPTION: Dc Power Jack, 5a, 20vdc, Black; MF: Global Connector Technology; MP: DCJ200-10-A-K1-K; PACKAGE: None; PRICE: None
JMP2-JMP7 = jump-0r-smd:0R-JUMP: SMD 0R 0805 Jumper
JP3 JP5 = jumper:JP2E: JUMPER
JP7 = pinhead:PINHD-1X8: PIN HEADER
JP8 = jumper:JP2Q: JUMPER
JP9 = pinhead:PINHD-2X5: PIN HEADER
JP12 = pinhead:PINHD-1X2: PIN HEADER
K1-K4 = BlueHome:FTR-K1CK005W: General Purpose Relays POWER Source: Datasheet <https://componentsearchengine.com/Datasheets/1/FTR-K1CK005W.pdf>; DESCRIPTION: General Purpose Relays POWER; HEIGHT: 15mm; MANUFACTURER_NAME: FUJITSU; MANUFACTURER_PART_NUMBER: FTR-K1CK005W; MOUSER_PART_NUMBER: 817-FTR-K1CK005W
LED10-LED13 LED17-LED21 = led:LED: LED OSRAM: - CHIPLED LG R971, LG N971, LY N971, LG Q971, LY Q971, LO R971, LY R971 LH N974, LH R974 LS Q976, LO Q976, LY Q976 LO Q996 - Hyper CHIPLED LW Q18S LB Q993, LB Q99A, LB R99A - SideLED LS A670, LO A670, LY A670, LG A670, LP A670 LB A673, LV A673, LT A673, LW A673 LH A674 LY A675 LS A676, LA A676, LO A676, LY A676, LW A676 LS A679, LY A679, LG A679 - Hyper Micro SIDELED® LS Y876, LA Y876, LO Y876, LY Y876 LT Y87S - SmartLED LW L88C, LW L88S LB L89C, LB L89S, LG L890 LS L89K, LO L89K, LY L89K LS L896, LA L896, LO L896, LY L896 - TOPLED LS T670, LO T670, LY T670, LG T670, LP T670 LSG T670, LSP T670, LSY T670, LOP T670, LYG T670 LG T671, LOG T671, LSG T671 LB T673, LV T673, LT T673, LW T673 LH T674 LS T676, LA T676, LO T676, LY T676, LB T676, LH T676, LSB T676, LW T676 LB T67C, LV T67C, LT T67C, LS T67K, LO T67K, LY T67K, LW E67C LS E67B, LA E67B, LO E67B, LY E67B, LB E67C, LV E67C, LT E67C LW T67C LS T679, LY T679, LG T679 LS T770, LO T770, LY T770, LG T770, LP T770 LB T773, LV T773, LT T773, LW T773 LH T774 LS E675, LA E675, LY E675, LS T675 LS T776, LA T776, LO T776, LY T776, LB T776 LHGB T686 LT T68C, LB T68C - Hyper Mini TOPLED® LB M676 - Mini TOPLED Santana® LG M470 LS M47K, LO M47K, LY M47K Source: http://www.osram.convergy.de LUXEON: - LUMILED® LXK2-PW12-R00, LXK2-PW12-S00, LXK2-PW14-U00, LXK2-PW14-V00 LXK2-PM12-R00, LXK2-PM12-S00, LXK2-PM14-U00 LXK2-PE12-Q00, LXK2-PE12-R00, LXK2-PE12-S00, LXK2-PE14-T00, LXK2-PE14-U00 LXK2-PB12-K00, LXK2-PB12-L00, LXK2-PB12-M00, LXK2-PB14-N00, LXK2-PB14-P00, LXK2-PB14-Q00 LXK2-PR12-L00, LXK2-PR12-M00, LXK2-PR14-Q00, LXK2-PR14-R00 LXK2-PD12-Q00, LXK2-PD12-R00, LXK2-PD12-S00 LXK2-PH12-R00, LXK2-PH12-S00 LXK2-PL12-P00, LXK2-PL12-Q00, LXK2-PL12-R00 Source: www.luxeon.com KINGBRIGHT: KA-3528ASYC Source: www.kingbright.com
R1-R6 R11-R18 R39-R77 = rcl:R-EU_: RESISTOR, European symbol; SPICEPREFIX: R
S3 S4 = BlueHome:FSM4JSMAATR: Switch Tactile OFF (ON) SPST Round Button Gull Wing 0.05A 24VDC 2.6N SMD T/R; AVAILABILITY: Unavailable; DESCRIPTION: Switch Tactile OFF _ON_ SPST Round Button Gull Wing 0.05A 24VDC 2.6N SMD T/R; MF: TE Connectivity; MP: FSM4JSMAATR; PACKAGE: None; PRICE: None; TE_PURCHASE_URL: https://www.te.com/usa-en/product-FSM4JSMAATR.html?te_bu=Cor&te_type=disp&te_campaign=seda_glo_cor-seda-global-disp-prtnr-fy19-seda-model-bom-cta_sma-317_1&elqCampaignId=32493
SJ1 SJ2 = jumper:SJ: SMD solder JUMPER
TP1 TP2 = testpad:PTR1: TEST PIN
U2 = BlueHome:SEMTECH_SX1503I091TRT: Low Voltage GPIO 20-Pin QFN-UT T/R; AMBIENT_TEMPERATURE_RANGE_HIGH: +85°C; AMBIENT_TEMPERATURE_RANGE_LOW: -40°C; CENTROID_NOT_SPECIFIED: No; DATASHEET: https://www.semtech.com/uploads/documents/sx150x.pdf; DEVICE_CLASS_L1: Integrated Circuits (ICs); DEVICE_CLASS_L2: Interface ICs; DEVICE_CLASS_L3: unset; DIGIKEY_DESCRIPTION: IC GPIO EXPANDER I2C 16CH 28-QFN; DIGIKEY_PART_NUMBER: SX1503I091CT-ND; HEIGHT: 0.6mm; INTERFACE: I2C; LEAD_FREE: yes; MAX_JUNCTION_TEMP: +125°C; MAX_SUPPLY_VOLTAGE: 5.5V; MF: Semtech; MFG_PACKAGE_IDENT: QFN-UT-28; MFG_PACKAGE_IDENT_DATE: 0; MFG_PACKAGE_IDENT_REV: 0; MIN_SUPPLY_VOLTAGE: 1.2V; MOUSER_PART_NUMBER: 947-SX1503I091TRT; MPN: SX1503I091TRT; NOMINAL_SUPPLY_CURRENT: 1uA; PACKAGE: QFN-UT-28; PREFIX: U; ROHS: yes; STANDOFF_HEIGHT: 0mm; TEMPERATURE_RANGE_HIGH: +125°C; TEMPERATURE_RANGE_LOW: -40°C; VERIFICATION_VERSION: 0.0.0.1
U3 = BlueHome:MIC4468YWM: None; AVAILABILITY: Unavailable; DESCRIPTION: MIC4468 Series 5 Ohm 1.2 A Quad Peak Low-Side MOSFET Driver - SOIC-16W; MF: Microchip; MP: MIC4468YWM; PACKAGE: SOIC-16 Microchip; PRICE: None
U4 = BlueHome:LM339ADR: QUAD DIFFERENTIAL COMPARATORS; AVAILABILITY: Unavailable; DESCRIPTION: Quad Differential Comparator 14-SOIC 0 to 70; MF: Texas Instruments; MP: LM339ADR; PACKAGE: SOIC-14 Texas Instruments; PRICE: None
U5 = BlueHome:74HC08D,652: Quad 2-input AND gate; AVAILABILITY: Unavailable; DESCRIPTION: 74HC Series 6 V Surface Mount High-Speed Quad 2-Input AND Gate - SOIC-14; MF: NXP Semiconductors; MP: 74HC08D,652; PACKAGE: SOIC-14 NXP Semiconductors; PRICE: None
U6 = BlueHome:SN74LVC1G74DCUR: SINGLE POSITIVE-EDGE-TRIGGERED D-TYPE FLIP-FLOP WITH CLEAR AND PRESET; AVAILABILITY: Unavailable; DESCRIPTION: Single Positive-Edge-Triggered D-Type Flip-Flop With Clear and Preset 8-VSSOP -40 to 125; MF: Texas Instruments; MP: SN74LVC1G74DCUR; PACKAGE: VFSOP-8 Texas Instruments; PRICE: None
U7 = BlueHome:TMP75BID: Temperature Sensor with I2C/SMBus Interface in Industry Standard LM75 Form Factor & Pinout 8-SOIC -40 to 125; AVAILABILITY: Unavailable; DESCRIPTION: 1.4V-Capable Temperature Sensor with I2C/SMBus Interface in LM75 Form Factor & Pinout 8-SOIC -55 to 125; MF: Texas Instruments; MP: TMP75BID; PACKAGE: SOIC-8 Texas Instruments; PRICE: None
U8 = BlueHome:IRM-05-5: AC-DC Single output Encapsulated power supply; Output 5Vdc at 1.0A; PCB mount, miniature size; AVAILABILITY: Unavailable; DESCRIPTION: AC-DC Single output Encapsulated power supply; Output 5Vdc at 1.0A; PCB mount, miniature size; MF: MEAN WELL; MP: IRM-05-5; PACKAGE: DIP-4 Mean Well; PRICE: None
U9 = BlueHome:LMS8117AMP-3.3: Low-Dropout Linear Regulator; AVAILABILITY: Unavailable; DESCRIPTION: IC Regulator LMS8117/SO-3.3/LMS8117AMP-3.3 NATIONAL SEMI RoHS V=3.3 SOT223; MF: Texas Instruments; MP: LMS8117AMP-3.3; PACKAGE: SOT-223 Texas Instruments; PRICE: None
U10 = BlueHome:ULN2003AIDG4: TRANSISTOR ARRAYS; AVAILABILITY: Unavailable; DESCRIPTION: High-Voltage, High-Current Darlington Transistor Array 16-SOIC -40 to 105; MF: Texas Instruments; MP: ULN2003AIDG4; PACKAGE: SOIC-16 Texas Instruments; PRICE: None
U11 = BlueHome:BLUENRG-232: Bluetooth Low Energy Wireless Soc; AVAILABILITY: Unavailable; DESCRIPTION: Bluetooth Low Energy Wireless Soc; MF: STMicroelectronics; MP: BLUENRG-232; PACKAGE: VFQFN-32 STMicroelectronics; PRICE: None
U12 U14 = BlueHome:ACS723LLCTR-40AB-T: None; AVAILABILITY: Unavailable; DESCRIPTION: High Accuracy, Galvanically Isolated Current Sensor IC With Small Footprint SOIC8 Package; MF: Allegro MicroSystems LLC; MP: ACS723LLCTR-40AB-T; PACKAGE: SOIC-8 Allegro MicroSystems LLC; PRICE: None
U13 = BlueHome:RV8564C3: Real Time Clock |SM| 3.7 x 2.5 mm | I2C Bus Sub miniature size AEC Q200 Rev C compliant Compliant with I2C-Bus interface (400kHz) Built in crystal for adjustment-free operation Programmable alarm, timer and interrupt functions Low power consumption datasheet <http://www.golledge.com/docs/products/rtcs/rv8564c3.htm?src=eagle>; AVAILABILITY: Unavailable; DESCRIPTION: Rtc Module 20ppm -40/+85; MF: Micro Crystal; MP: RV-8564-C3; PACKAGE: None; PRICE: None
U$1 U$2 U$7 U$8 = BlueHome:BUK9840-55
U$3-U$6 U$11 U$19 U$22 = BlueHome:BZB984
U$9 U$20 = BlueHome:RND170-00004
U$18 U$24 U$26 = BlueHome:L
U$21 = BlueHome:LM23610
U$23 = BlueHome:STAR_GROUND
U$25 = BlueHome:BALF-NRG-01D3; AVAILABILITY: Unavailable; DESCRIPTION: 50 Ω nominal input / conjugate match balun to BlueNRG transceiver, with integrated harmonic filter; MF: STMicroelectronics; MP: BALF-NRG-01D3; PACKAGE: WFBGA-4 STMicroelectronics; PRICE: None
VR1 = BlueHome:TS53YJ103MR10: Res Cermet Trimmer 10K Ohm 20% 1/4W 1(Elec)/1(Mech)Turn 2.5mm (5 X 5.5 X 2.7mm) J-Hook SMD T/R; AVAILABILITY: Unavailable; DESCRIPTION: Res Cermet Trimmer 10K Ohm 20% 1/4W 1_Elec_/1_Mech_Turn 2.5mm _5 X 5.5 X 2.7mm_ J-Hook SMD T/R; MF: Vishay; MP: TS53YJ103MR10; PACKAGE: TSOP-34830 Vishay; PRICE: None
X1-X3 = BlueHome:2081-1228: Serie 2081, Klemmenleiste mit Betätigungsdrückern mit abgewinkelten Lötstiften versetzt (alternierend) / Series 2081, Terminal strip with push-buttons with angled, staggered solder pins Polzahl / Pole No.: 8 Rastermaß / Pitch: 3.5 mm Bemessungsspannung / Rated Voltage: 320 V Nennstrom / Nominal Current: 17.5 A Leiterquerschnitt / Conductor Size: 0.2 - 1.5 mm2 Anschlusstechnik / Connection Technology: CAGE CLAMP® S Lötstiftlänge: / Solder Pin Length: 3.6 mm Leitereinführung (zur Platine) / Conductor entry angle (to PCB): 0 ° Farbe / Color: grau / gray Stand: 01.01.2014. Die jeweils aktuellen Daten zu diesem Artikel finden Sie in unserem Produktkatalog, den Sie unter www.wago.com einsehen können. As of: 01/01/2014. Please find the newest data for this article in our product catalogue, which can be viewed under www.wago.com.
X4 = BlueHome:2081-1222: Serie 2081, Klemmenleiste mit Betätigungsdrückern mit abgewinkelten Lötstiften versetzt (alternierend) / Series 2081, Terminal strip with push-buttons with angled, staggered solder pins Polzahl / Pole No.: 2 Rastermaß / Pitch: 3.5 mm Bemessungsspannung / Rated Voltage: 320 V Nennstrom / Nominal Current: 17.5 A Leiterquerschnitt / Conductor Size: 0.2 - 1.5 mm2 Anschlusstechnik / Connection Technology: CAGE CLAMP® S Lötstiftlänge: / Solder Pin Length: 3.6 mm Leitereinführung (zur Platine) / Conductor entry angle (to PCB): 0 ° Farbe / Color: grau / gray Stand: 01.01.2014. Die jeweils aktuellen Daten zu diesem Artikel finden Sie in unserem Produktkatalog, den Sie unter www.wago.com einsehen können. As of: 01/01/2014. Please find the newest data for this article in our product catalogue, which can be viewed under www.wago.com.
X5 = con-wago-500:W237-102: WAGO SCREW CLAMP; MPN: 237-102; OC_FARNELL: unknown; OC_NEWARK: 70K9898
Y3 = BlueHome:ECS-160-12-36-AGN-TR: The minature ECX-2236 is a compact SMD Crystal. The industry standard 2.5 x 2.0 x 0.55 mm ceramic package is ideal for today’s SMD manufacturing environment.; AVAILABILITY: Unavailable; DESCRIPTION: Crystal 16MHz ±25ppm _Tol_ ±30ppm _Stability_ 12pF FUND 80Ohm 4-Pin Mini-CSMD T/R; MF: ECS Inc.; MP: ECS-160-12-36-AGN-TR; PACKAGE: SMD-4 ECS International; PRICE: None
Y4 = BlueHome:NX2012SA-32.768K-STD-MUB-1: Crystal 32.7680khz 12.5pf Smd; AVAILABILITY: Unavailable; DESCRIPTION: Crystal 32.7680khz 12.5pf Smd; MF: NDK America,; MP: NX2012SA-32.768K-STD-MUB-1; PACKAGE: SMD-2 NDK; PRICE: None